# EAGLE design GNSS_Splitter (EAGLE 9.6.2)
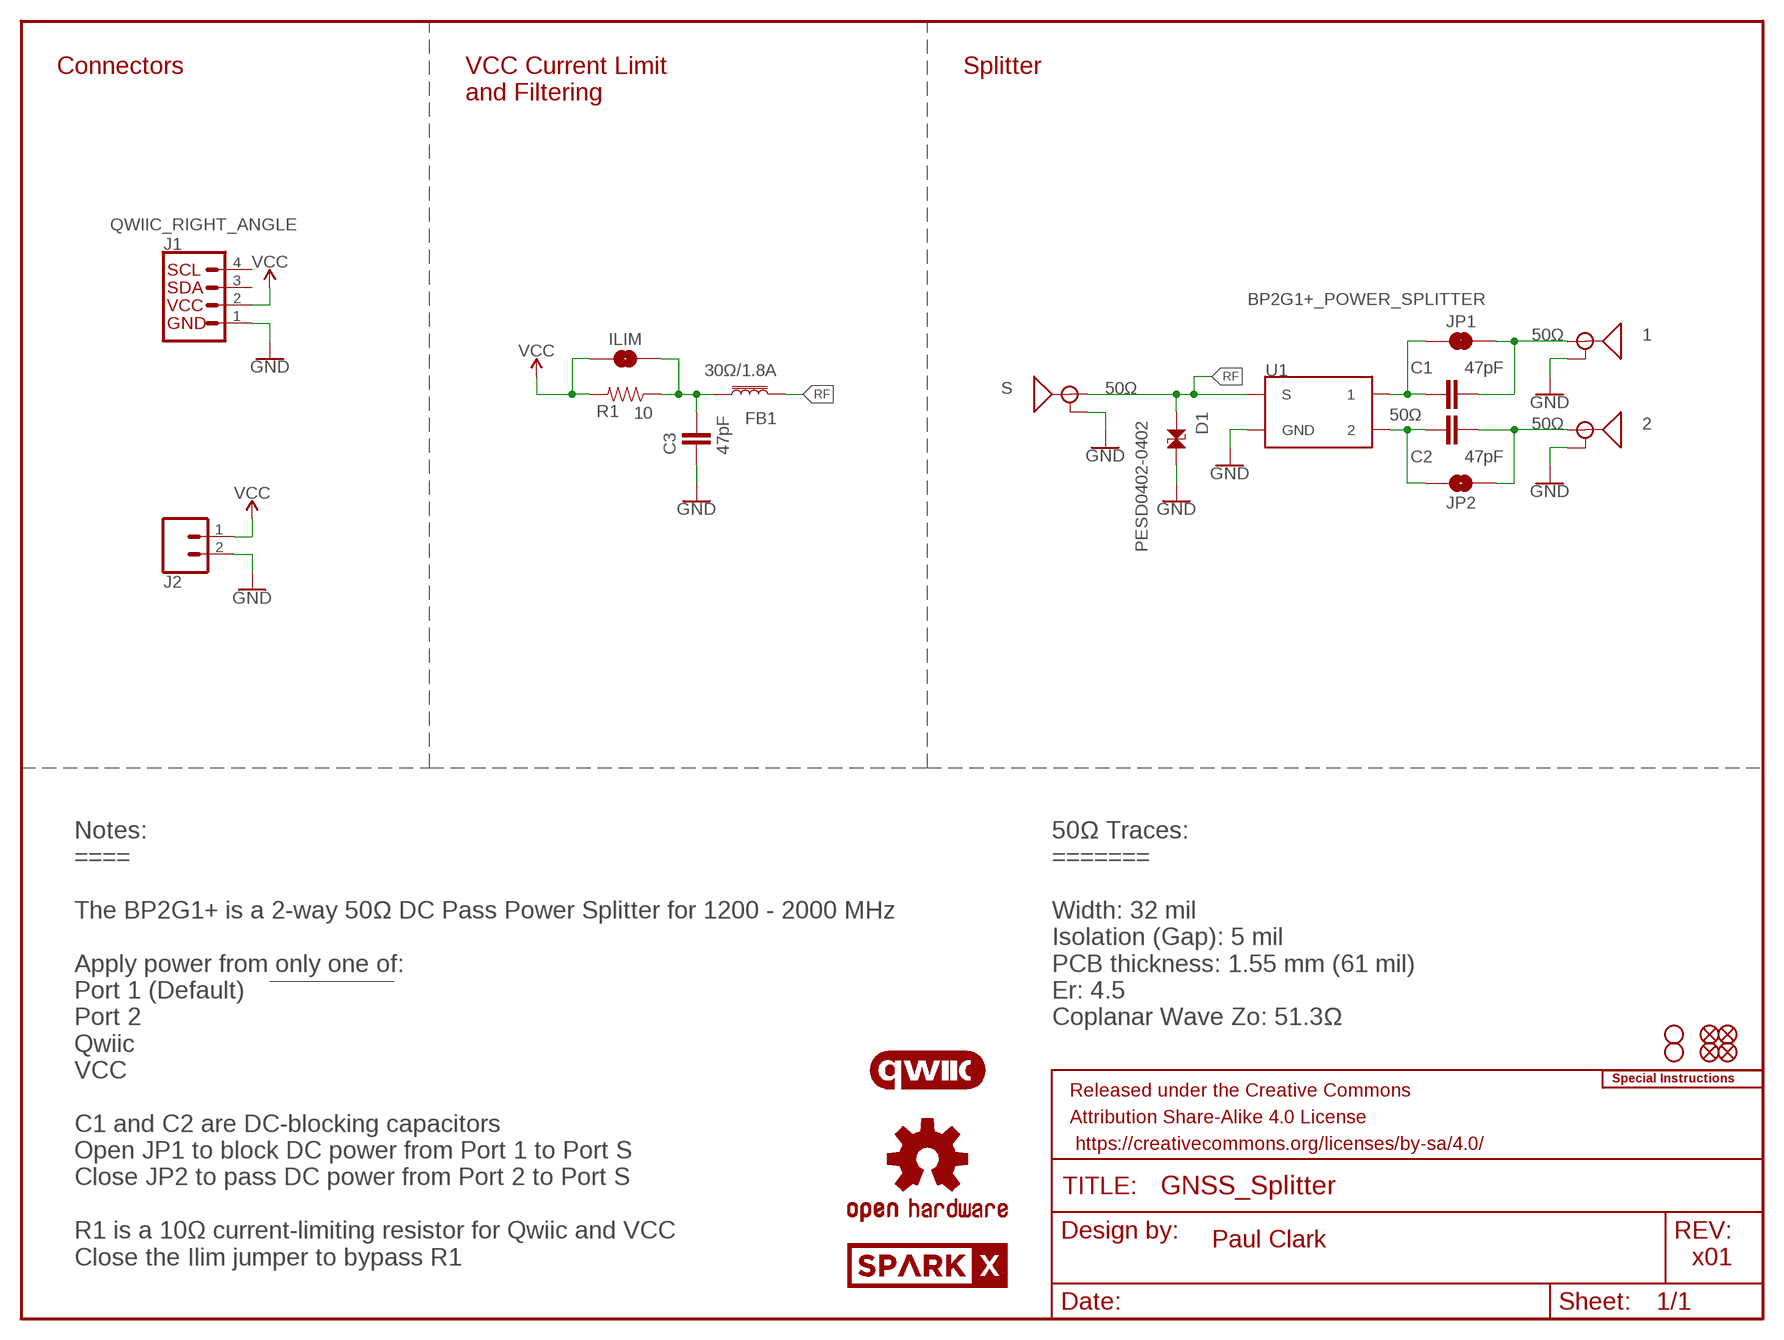
[diagram p0: schematic, sheet 1]

## Parts
1  ANTENNA-SMA-GROUNDEDEDGE_SMA  [SMA-EDGE]
2  ANTENNA-SMA-GROUNDEDEDGE_SMA  [SMA-EDGE]
C1  47pF  47PF-0603-50V-5%  [0603]
C2  47pF  47PF-0603-50V-5%  [0603]
C3  47pF  47PF-0603-50V-5%  [0603]
D1  PESD0402-0402  [0402]
FB1  30Ω/1.8A  FERRITE_BEAD-0603  [0603]
FD1  FIDUCIAL1X2  [FIDUCIAL-1X2]
FD2  FIDUCIAL1X2  [FIDUCIAL-1X2]
FD3  FIDUCIAL1X2  [FIDUCIAL-1X2]
FD4  FIDUCIAL1X2  [FIDUCIAL-1X2]
FRAME1  FRAME-LETTER  [CREATIVE_COMMONS]
H1  STAND-OFF  [STAND-OFF]
H2  STAND-OFF  [STAND-OFF]
ILIM  JUMPER-SMT_2_NO_SILK  [SMT-JUMPER_2_NO_SILK]
J1  QWIIC_RIGHT_ANGLE  QWIIC_CONNECTORJS-1MM  [JST04_1MM_RA]
J2  CONN_021X02_NO_SILK  [1X02_NO_SILK]
JP1  JUMPER-SMT_2_NC_TRACE_SILK  [SMT-JUMPER_2_NC_TRACE_SILK]
JP2  JUMPER-SMT_2_NO_SILK  [SMT-JUMPER_2_NO_SILK]
LOGO1  OSHW-LOGOS  [OSHW-LOGO-S]
LOGO2  QWIIC_LOGO_6MM  [QWIIC_6MM]
LOGO3  SPECIAL_INSTRUCTIONS-ORDERING  [ORDERING_INSTRUCTIONS]
R1  10  10OHM-0603-1/10W-1%  [0603]
S  ANTENNA-SMA-GROUNDEDEDGE_SMA  [SMA-EDGE]
U1  BP2G1+_POWER_SPLITTER  [XX21]
U$1  SPARKX-LOGO3  [SPARKX-SMALL]
U$2  SPARKX-LOGO3  [SPARKX-SMALL]

## Nets
GND: 1.GND@0(GND) 1.GND@1(GND) 1.GND@2(GND) 1.GND@3(GND) 2.GND@0(GND) 2.GND@1(GND) 2.GND@2(GND) 2.GND@3(GND) C3.1 D1.2 J1.1 J2.2 S.GND@0(GND) S.GND@1(GND) S.GND@2(GND) S.GND@3(GND) U1.1(GND) U1.3(GND) U1.4(GND) U1.6(GND) U1.7(GND)
N$1: C1.1 JP1.1 U1.8
N$2: C3.2 FB1.1 ILIM.2 R1.1
N$3: C2.2 JP2.2 U1.5
N$5: 2.SIG(SIGNAL) C2.1 JP2.1
N$6: 1.SIG(SIGNAL) C1.2 JP1.2
RF: D1.1 FB1.2 S.SIG(SIGNAL) U1.2(S)
VCC: ILIM.1 J1.2 J2.1 R1.2
Unconnected: J1.3 J1.4

## Notes on the sheet
- Connectors
- VCC Current Limit
  and Filtering
- Splitter
- 50Ω
- 50Ω
- 50Ω
- 50Ω
- Notes:
  ====
  
  The BP2G1+ is a 2-way 50Ω DC Pass Power Splitter for 1200 - 2000 MHz
  
  Apply power from only one of:
  Port 1 (Default)
  Port 2
  Qwiic
  VCC
  
  C1 and C2 are DC-blocking capacitors
  Open JP1 to block DC power from Port 1 to Port S
  Close JP2 to pass DC power from Port 2 to Port S
  
  R1 is a 10Ω current-limiting resistor for Qwiic and VCC
  Close the Ilim jumper to bypass R1
- 50Ω Traces:
  =======
  
  Width: 32 mil
  Isolation (Gap): 5 mil
  PCB thickness: 1.55 mm (61 mil)
  Er: 4.5
  Coplanar Wave Zo: 51.3Ω
- Paul Clark
- x01

## Library data of the parts
1 2 S = SparkFun-RF:ANTENNA-SMA-GROUNDED: SMA Antenna Connector w/ Ground Edge-mount and SMD SMA connectors for RF Antennas. **4-LAYER BOARD WARNING!!** When designing a 4-layer board using any of the SMD variants, you will need to manually add a cutout polygon on any internal power layers to make sure that you don't end up with exposed copper around the edge of the routed hole for these connectors. Exposed power copper could then short to the connector body - and that would be bad. Why hasn't anyone added the cutout polygons directly to the connector footprint? Well, your internal layers (usually 2 and 15) may be covered with GND polygons and you might well want the copper to go all the way to the edge, especially under the connector SIGNAL pin. So adding cutouts to the footprint might make matters worse, not better...; PROD_ID: CONN-08289
C1-C3 = SparkFun-Capacitors:47PF: 47pF ceramic capacitors A capacitor is a passive two-terminal electrical component used to store electrical energy temporarily in an electric field.; PROD_ID: CAP-08913
D1 = SparkFun-DiscreteSemi:PESD0402: ESD protection diode PESD is used to protect a signal line from ESD.; DIGIKEY_PART: PESD0402-140CT-ND; MOUSE_PART: 650-PESD0402-140; PROD_ID: DIO-15359
FB1 = SparkFun-Coils:FERRITE_BEAD: Ferrite Bead (blocks, cores, rings, chokes, etc.) Inductor with layers of ferrite used to suppress high frequencies. Often used to isolate high frequency noise. SparkFun Products: IOIO-OTG - V2.2 <https://www.sparkfun.com/products/13613> SparkFun SAMD21 Mini Breakout <https://www.sparkfun.com/products/13664> SparkFun 6 Degrees of Freedom Breakout - LSM6DS3 <https://www.sparkfun.com/products/13339> SparkFun SAMD21 Dev Breakout <https://www.sparkfun.com/products/13672> Lilypad MP3 <https://www.sparkfun.com/products/11013>; PROD_ID: NDUC-13805
FD1-FD4 = SparkFun-Aesthetics:FIDUCIAL: Fiducial Alignment Points Point-of-reference for pick-and-place machines and other optical instruments.
FRAME1 = SparkFun-Aesthetics:FRAME-LETTER: Schematic Frame - Letter Standard 8.5x11 US Letter frame
H1 H2 = SparkFun-Hardware:STAND-OFF: Stand Off Drill holes for mechanically mounting via screws, standoffs, etc. Note: Use the keepout ring to avoid running the screw head into surrounding components. Variant Overviews STAND-OFF - Mechanical footprint for a #4 phillips button head screw. STAND-OFF-TIGHT - Mechanical footprint for a #4 phillips button head screw, Example SparkFun Products Screw - Phillips Head (1/4", 4-40, 10 pack) <https://www.sparkfun.com/products/10453> (PRT-10453) Screw - Phillips Head (1/2", 4-40, 10 pack) <https://www.sparkfun.com/products/10452> (PRT-10452) Screw - Phillips Head (3/4", 4-40, 10 pack) <https://www.sparkfun.com/products/10451> (PRT-10451) Screw - Phillips Head (1", 4-40, 10 pack) <https://www.sparkfun.com/products/10450> (PRT-10450)
ILIM JP2 = SparkFun-Jumpers:JUMPER-SMT_2_NO: Normally open jumper This jumper has two pads in close proximity to each other. Apply solder to close the connection. Round pads are easier to solder for beginners, but are a lot larger. SparkFun Product that uses the round pads: SparkFun EL Sequencer <https://www.sparkfun.com/products/12781>
J1 = SparkFun-Connectors:QWIIC_CONNECTOR: SparkFun I2C Standard Qwiic Connector An SMD 1mm pitch JST connector makes it easy and quick (get it? Qwiic?) to connect I2C devices to each other. The Qwiic system <http://www.sparkfun.com/qwiic> enables fast and solderless connection between popular platforms and various sensors and actuators. We carry 200mm <https://www.sparkfun.com/products/14204>, 100mm <https://www.sparkfun.com/products/14205>, 50mm <https://www.sparkfun.com/products/14206>, and breadboard friendly <https://www.sparkfun.com/products/14207> Qwiic cables. We also offer 10 pcs strips <https://www.sparkfun.com/products/14323> the SMD connectors.; PROD_ID: CONN-13694
J2 = SparkFun-Connectors:CONN_02: Multi connection point. Often used as Generic Header-pin footprint for 0.1 inch spaced/style header connections On any of the 0.1 inch spaced packages, you can populate with these: Break Away Headers - Straight <https://www.sparkfun.com/products/116> (PRT-00116) Break Away Male Headers - Right Angle <https://www.sparkfun.com/products/553> (PRT-00553) Female Headers <https://www.sparkfun.com/products/115> (PRT-00115) Break Away Headers - Machine Pin <https://www.sparkfun.com/products/117> (PRT-00117) Break Away Female Headers - Swiss Machine Pin <https://www.sparkfun.com/products/743> (PRT-00743) For SCREWTERMINALS and SPRING TERMINALS visit here: Screw Terimnals on SparkFun.com <https://www.sparkfun.com/search/results?term=Screw+Terminals> (5mm/3.5mm/2.54mm spacing) This device is also useful as a general connection point to wire up your design to another part of your project. Our various solder wires solder well into these plated through hole pads. Hook-Up Wire - Assortment (Stranded, 22 AWG) <https://www.sparkfun.com/products/11375> (PRT-11375) Hook-Up Wire - Assortment (Solid Core, 22 AWG) <https://www.sparkfun.com/products/11367> (PRT-11367) View the entire wire category on our website here <https://www.sparkfun.com/categories/141> Special notes: Molex polarized connector foot print use with: PRT-08233 with associated crimp pins and housings. 2.54_SCREWTERM for use with PRT-10571. 3.5mm Screw Terminal footprints for PRT-08084 5mm Screw Terminal footprints for use with PRT-08432
JP1 = SparkFun-Jumpers:JUMPER-SMT_2_NC_TRACE: Normally closed trace jumper This jumper has a trace between two pads so it's normally closed (NC). Use a razor knife to open the connection. For best results follow the IPC guidelines for cutting traces: Cutout at least 0.063 mm (0.005 in). Remove all loose material to clean up the cut area. Seal the cut with an approved epoxy. Reapply solder to reclose the connection.
LOGO1 = SparkFun-Aesthetics:OSHW-LOGO: Open-Source Hardware (OSHW) Logo This logo indicates the piece of hardware it is found on incorporates a OSHW license and/or adheres to the definition of open source hardware found here: http://freedomdefined.org/OSHW
LOGO2 = SparkFun-Aesthetics:QWIIC_LOGO: Qwiic Logos for placement on schematic and PCB. The 5.5mm silk logo is best for placing next to Qwiic connector.
LOGO3 = SparkFun-Aesthetics:SPECIAL_INSTRUCTIONS: Special Ordering/Production Instructions Alert Symbol for special PCB ordering instructions or unique production process warnings. Ordering Instructions Production Instructions Types of information that should be added to box: Copper weight Soldermask color Silk color PCB thickness Number of layers PCB Standard: 1.6mm FR4 1 oz copper immersion silver plating red soldermask white silkscreen Types of information that should be added to box: Special wash requirements Depaneling instructions Humidification Glue curing Default text settings: 0.07 inch 9% ratio 50% line distance
R1 = SparkFun-Resistors:10OHM: 10Ω resistor A resistor is a passive two-terminal electrical component that implements electrical resistance as a circuit element. Resistors act to reduce current flow, and, at the same time, act to lower voltage levels within circuits. - Wikipedia; PROD_ID: RES-12581
U1 = SparkFun-RF:BP2G1+_POWER_SPLITTER: BP2G1+ 2 Ways MMIC DC Pass Power Splitter, 1200 - 2000 MHz, 50Ω; PROD_ID: IC-17198
U$1 U$2 = SparkX:SPARKX-LOGO

## Board
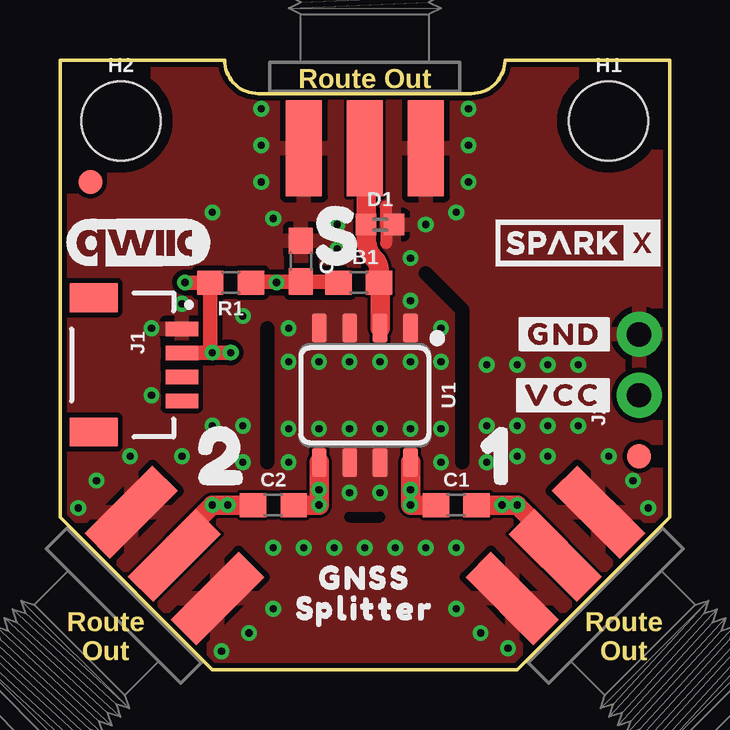
[diagram p1: board, top side]
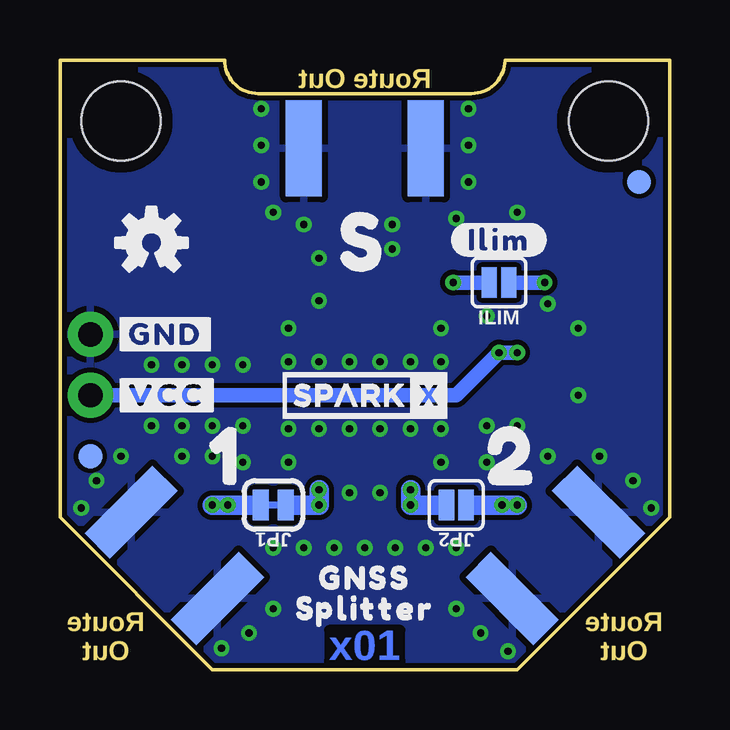
[diagram p2: board, bottom side, seen from below]

Size 25.4 x 25.4 mm. Coordinates in mm from the lower left corner, seen from the top.
Outline: 0,6.35 6.35,0 19.05,0 25.4,6.35 25.4,25.4 18.54,25.4 arc-90 17.14,24 8.26,24 arc-90 6.86,25.4 0,25.4 0,6.35
Copper layers (1*16): Top 0.035mm / dielectric 1.5mm / Bottom 0.035mm
Design rules "SparkFun-2-Layer-General-JLCPCB *": minimum track width 7mil, minimum drill 0.3mm, track to track 5mil, track to pad 5mil, pad to pad 7mil, via to via 7mil, smd to smd 7mil, copper to edge 7mil, drill to drill 7mil, minimum pad ring 7mil, minimum via ring 7mil, stop-mask expansion 3mil, vias tented up to drill 25mil, thermal gap 10mil
tRestrict: 7 lines

### Footprints (pad centres in the part's own frame; a part is rotated, then mirrored left to right if it is on the bottom)
SMA-EDGE = smd 1.5 x 4: GND@0 -2.54,0; GND@1 2.54,0; SIG 0,0 | smd 1.5 x 4 bottom: GND@2 -2.54,0; GND@3 2.54,0
0603 = smd 1.1 x 1: 1 -0.85,0; 2 0.85,0
0402 = smd 0.85 x 0.9: 1 -0.58,0; 2 0.58,0
FIDUCIAL-1X2 = smd 1 x 1: 1 0,0
STAND-OFF = hole 3.302: 0,0
SMT-JUMPER_2_NO_SILK = smd 0.635 x 1.27: 1 -0.406,0; 2 0.406,0
JST04_1MM_RA = smd 0.6 x 1.35: 1 -1.5,0; 2 -0.5,0; 3 0.5,0; 4 1.5,0 | smd 1.2 x 2: NC1 2.8,-3.675; NC2 -2.8,-3.675
1X02_NO_SILK = drill 1.016 pad 1.88: 1 0,0; 2 2.54,0
SMT-JUMPER_2_NC_TRACE_SILK = smd 0.66 x 1.27: 1 -0.521,0; 2 0.521,0
XX21 = smd 0.6 x 1.2: 1 -1.905,-2.8; 2 -0.635,-2.8; 3 0.635,-2.8; 4 1.905,-2.8; 5 1.905,2.8; 6 0.635,2.8; 7 -0.635,2.8; 8 -1.905,2.8

### Placement (x,y rotation side)
1  20.64,4.76 225 top
2  4.76,4.76 135 top
C1  16.51,6.86 0 top
C2  8.89,6.86 0 top
C3  10.03,17.02 270 top
D1  13.34,18.54 0 top
FB1  12.45,16.13 0 top
FD1  1.27,20.32 0 bottom
FD2  1.27,20.32 0 top
FD3  24.13,8.89 0 bottom
FD4  24.13,8.89 0 top
FRAME1  64.77,-10.16 0 top  (outside the outline)
H1  22.86,22.86 0 top
H2  2.54,22.86 0 top
ILIM  7.11,16.13 180 bottom
J1  5.08,12.7 270 top
J2  24.13,11.43 90 top
JP1  16.51,6.86 180 bottom
JP2  8.89,6.86 180 bottom
LOGO1  21.59,17.78 0 bottom
LOGO2  3.3,17.78 0 top
LOGO3  38.1,49.53 0 top  (outside the outline)
R1  7.11,16.13 180 top
S  12.7,21.72 0 top
U1  12.7,11.43 180 top
U$1  21.59,17.78 0 top
U$2  12.7,11.43 0 bottom
U$3  [10]  18.29,8.89 0 top
U$4  [20]  6.86,8.89 0 top
U$5  [S0]  11.68,18.03 0 top
U$6  [S0]  12.7,17.78 0 bottom
U$7  [10]  18.41,8.89 0 bottom
U$8  [20]  6.48,8.89 0 bottom
U$9  [#GND#0]  23.24,13.97 0 top
U$10  [#GND#1]  23.24,13.97 0 bottom
U$11  [#VCC#0]  23.24,11.43 0 top
U$12  [#VCC#1]  23.24,11.43 0 bottom
U$13  [GNSS0]  12.7,3.81 0 top
U$14  [P0]  11.05,2.29 0 top
U$15  [S__LITTER0]  12.7,2.54 0 top
U$16  [GNSS0]  12.7,3.81 0 bottom
U$17  [S__LITTER0]  12.7,2.54 0 bottom
U$18  [P0]  14.35,2.29 0 bottom
U$19  [#ILIM#0]  7.11,17.91 0 bottom

### Tracks (layer width: path | path; a pad name or v marks a point on that pad's centre or on a via)
GND  (via drill 0.3)
  Top 0.305: D1.2 13.59,18.54
  Top 0.508: 13.59,19.3 13.59,18.54 13.59,17.78
  other vias: 10.79,12.83 12.06,12.83 14.61,12.83 9.53,14.22 7.62,14.73 5.08,15.24 3.81,14.22 12.06,10.03 13.34,10.03 14.61,10.03 10.79,10.03 13.34,12.83 11.56,18.54 15.24,18.54 8.89,18.8 8.38,20.32 8.38,23.37 8.38,21.84 17.02,23.37 17.02,21.84 17.02,20.32 14.61,15.37 12.06,7.37 13.34,7.37 8.89,5.08 16.51,5.08 8.89,2.54 16.51,2.54 7.87,1.52 6.73,0.76 17.53,1.52 18.67,0.89 23.88,7.87 22.86,8.89 24.51,6.73 1.52,7.87 2.92,8.89 0.76,6.73 6.35,10.16 7.62,10.16 15.88,10.03 9.53,10.03 17.78,10.16 19.05,10.16 20.32,10.16 15.88,12.83 17.78,12.7 19.05,12.7 20.32,12.7 21.59,12.7 21.59,10.16 3.81,11.43 7.62,8.64 9.53,8.64 10.16,5.08 11.43,5.08 12.7,5.08 13.97,5.08 15.24,5.08 15.88,8.64 17.78,8.64 19.05,8.89 20.32,8.89 5.08,8.89 15.88,14.22 16.51,19.05 9.53,12.83 6.35,19.05 14.61,17.14 11.56,17.53
  pour Top (isolate 0.203): 0,25.4 25.4,25.4 25.4,0 0,0
  pour Bottom (isolate 0.203): 0,25.4 25.4,25.4 25.4,0 0,0
  pour Top (isolate 0.127, rank 2): 10.79,25.4 14.61,25.4 14.61,16.76 14.32,16.48 14.22,12.7 12.45,12.7 12.45,16.51 10.79,18.16
  pour Top (isolate 0.127, rank 2): 1.71,4.64 4.64,1.71 8,5.08 17.4,5.08 20.76,1.71 23.69,4.64 20.45,7.87 15.88,7.87 15.88,10.03 9.53,10.03 9.53,7.87 4.95,7.87
N$1  (via drill 0.3)
  Top 0.813: U1.8 v14.61,7.49 v14.61,6.86 C1.1
  Bottom 0.406: 15.89,6.86 JP1.1
  Bottom 0.813: v14.61,7.49 v14.61,6.86 15.89,6.86
N$2  (via drill 0.3)
  Top 0.61: FB1.1 11.56,16.17 C3.2 9.06,16.17 | 9.06,16.17 v9.02,16.13 | R1.1 8,16.17 9.06,16.17
  Bottom 0.61: v9.02,16.13 ILIM.2
N$3  (via drill 0.3)
  Top 0.813: U1.5 v10.79,7.49 v10.79,6.86 C2.2
  Bottom 0.406: 9.38,6.86 JP2.2
  Bottom 0.813: v10.79,7.49 v10.79,6.86 9.38,6.86
N$5  (via drill 0.3)
  Top 0.813: C2.1 v6.99,6.86 v6.35,6.86 4.76,5.27 2.SIG
  Bottom 0.406: 8.39,6.86 JP2.1
  Bottom 0.813: v6.35,6.86 v6.99,6.86 8.39,6.86
N$6  (via drill 0.3)
  Top 0.813: C1.2 v18.41,6.86 v19.05,6.86 20.64,5.27 1.SIG
  Bottom 0.406: 17.13,6.86 JP1.2
  Bottom 0.813: v19.05,6.86 v18.41,6.86 17.13,6.86
RF
  Top 0.813: S.SIG 12.76,21.66 D1.1 12.76,17.93 arc45 13.08,17.14 arc-45 13.3,16.63 FB1.2 13.34,16.09 U1.2
VCC  (via drill 0.3)
  Top 0.61: J1.2 v6.34,13.2 v6.35,13.21 | v7.11,13.21 v6.35,13.21 | v6.35,13.21 6.26,13.3 R1.2 v5.21,16.13
  Bottom 0.61: v6.35,13.21 v7.11,13.21 8.89,11.43 J2.1 | v5.21,16.13 ILIM.1

### Text on the board
Bottom: x01
Milling: Route Out | Route / Out | Route / Out
Measures: Dimensions in inches
tDocu: 2-layer PCB / 1.6mm thickness / 1oz Copper / HASL lead-free surface finish / Black solder resist / White silkscreen | Paul Clark